# Altium project JFET.PrjPcb
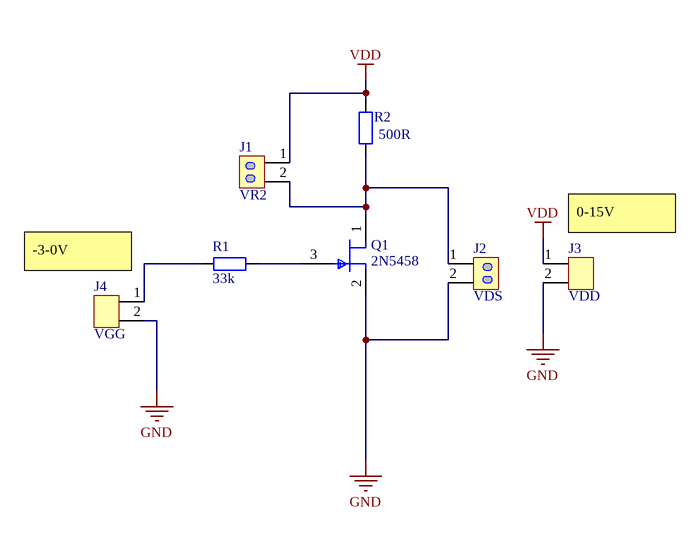
[diagram p0: CEF JFET.SchDoc]
1 sheet, 7 parts. Net scope: global (net labels, ports and power ports of the same name join across sheets).
Board file: CEF JFET.PcbDoc

## Sheet CEF JFET.SchDoc
size A4; SheetNumber: 1; SheetTotal: 1

### Parts
J1  VR2  [HDR_1x2_pin]
J2  VDS  [HDR_1x2_pin]
J3  VDD  [HDR_1X2_TE]
J4  VGG  [HDR_1X2_TE]
Q1  2N5458  [FP-29-11-MFG]
R1  33k  [Resistor]
R2  500R  [Resistor]

### Nets
GND: J2.2 J3.2 J4.2 Q1.2(SOURCE)
VDD: J1.1 J3.1 R2.2
NetJ1_2: J1.2 J2.1 Q1.1(DRAIN) R2.1
NetJ4_1: J4.1 R1.1
NetQ1_3: Q1.3(GATE) R1.2

### Notes on the sheet
- (near J4) -3-0V
- (near J3) 0-15V

### Library data of the parts
J1 J2 = HDR_1x2: Header, 2-Pin
J3 J4 = CON_1x2: Connector, 2-Ports
Q1 = CMP-00278-00153544-1: 2N5458 Small Signal Field-Effect Transistor, 25V, 1-Element, N-Channel, Silicon, Junction FET, TO-92; NexarPartId: 153544; Manufacturer Lifecycle Status: OBSOLETE; Element Configuration: Single; Power Dissipation: 625mW; Input Capacitance: 7pF; Max Junction Temperature (Tj): 135°C; Continuous Drain Current (ID): 9mA; Gate to Source Voltage (Vgs): -25V; Number of Channels: 1; Current Rating: 10mA; Drain to Source Voltage (Vdss): 25V; Max Operating Temperature: 135°C; Number of Pins: 3; Weight: 201mg; Breakdown Voltage: 25V; Lead Free: Lead Free; Case/Package: TO-92; Lifecycle Status: Obsolete; RoHS: Compliant; Packaging: Bulk; Min Operating Temperature: -55°C; Height: 7.87mm; Mount: Through Hole; Drain to Source Breakdown Voltage: 25V; REACH SVHC: No SVHC; Max Power Dissipation: 625mW; Voltage Rating (DC): 25V
R1 R2 = Resistor 0.25W 5mm: 0.25W,Axial